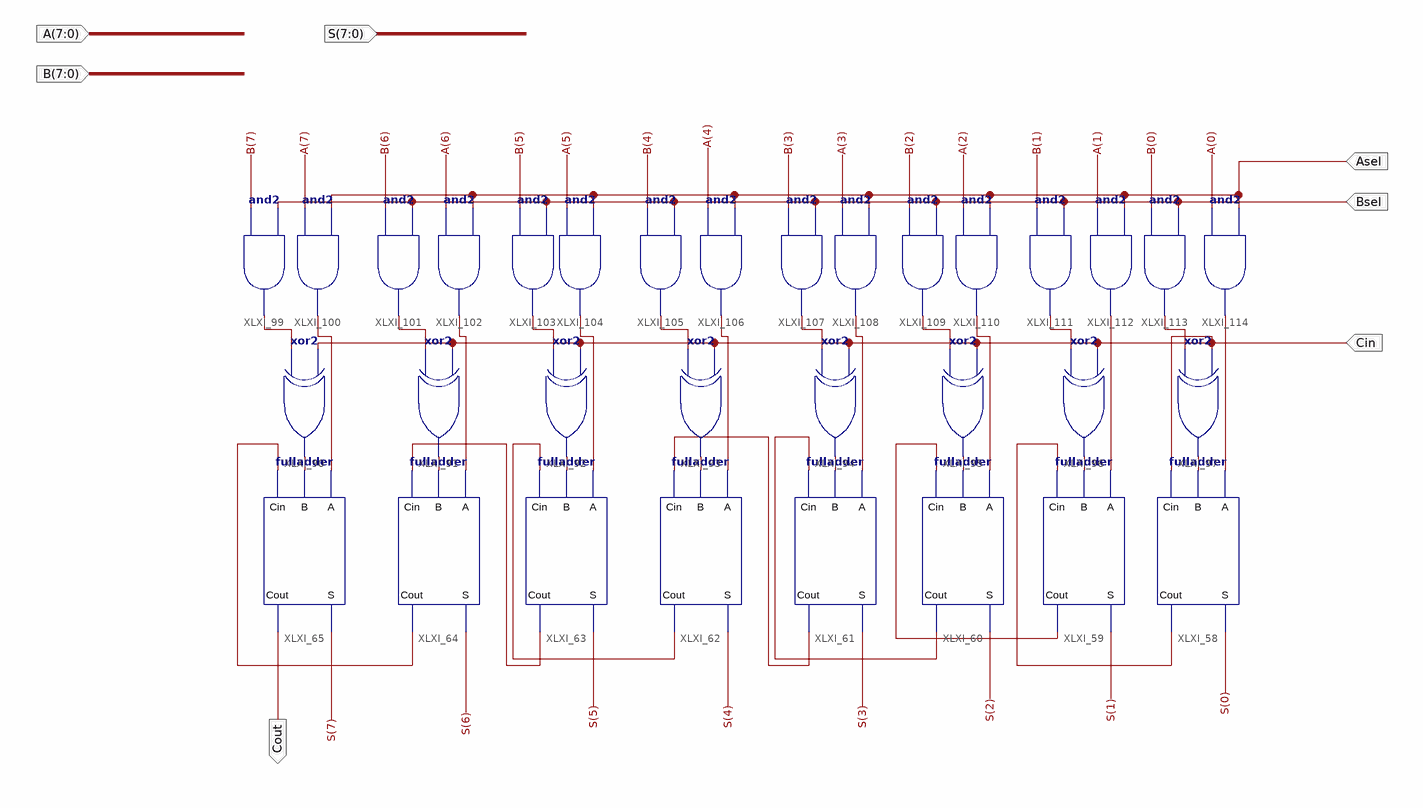
[diagram p0: schematic sheet 1]
// Xilinx ISE schematic eightBitFullAdder.sch (spartan3) as structural Verilog: 32 symbols, 7 ports
module eightBitFullAdder (
  input  Cin,
  input  Bsel,
  input  Asel,
  input  [7:0] A,
  input  [7:0] B,
  output Cout,
  output [7:0] S
);

  wire XLXN_103, XLXN_104, XLXN_105, XLXN_106, XLXN_107, XLXN_108, XLXN_109, XLXN_110, XLXN_111, XLXN_112,
       XLXN_113, XLXN_114, XLXN_115, XLXN_116, XLXN_117, XLXN_141, XLXN_142, XLXN_143, XLXN_144, XLXN_145,
       XLXN_146, XLXN_147, XLXN_148, XLXN_149, XLXN_150, XLXN_151, XLXN_152, XLXN_153, XLXN_154, XLXN_155,
       XLXN_156;

  fulladder XLXI_58 (.A(XLXN_156), .B(XLXN_117), .Cin(Cin), .S(S[0]), .Cout(XLXN_109));
  fulladder XLXI_59 (.A(XLXN_154), .B(XLXN_116), .Cin(XLXN_109), .S(S[1]), .Cout(XLXN_108));
  fulladder XLXI_60 (.A(XLXN_152), .B(XLXN_115), .Cin(XLXN_108), .S(S[2]), .Cout(XLXN_107));
  fulladder XLXI_61 (.A(XLXN_150), .B(XLXN_114), .Cin(XLXN_107), .S(S[3]), .Cout(XLXN_106));
  fulladder XLXI_62 (.A(XLXN_148), .B(XLXN_113), .Cin(XLXN_106), .S(S[4]), .Cout(XLXN_105));
  fulladder XLXI_63 (.A(XLXN_146), .B(XLXN_112), .Cin(XLXN_105), .S(S[5]), .Cout(XLXN_104));
  fulladder XLXI_64 (.A(XLXN_144), .B(XLXN_111), .Cin(XLXN_104), .S(S[6]), .Cout(XLXN_103));
  fulladder XLXI_65 (.A(XLXN_142), .B(XLXN_110), .Cin(XLXN_103), .S(S[7]), .Cout(Cout));
  xor XLXI_90 (XLXN_110, XLXN_141, Cin);
  xor XLXI_91 (XLXN_111, XLXN_143, Cin);
  xor XLXI_92 (XLXN_112, XLXN_145, Cin);
  xor XLXI_93 (XLXN_113, XLXN_147, Cin);
  xor XLXI_94 (XLXN_114, XLXN_149, Cin);
  xor XLXI_95 (XLXN_115, XLXN_151, Cin);
  xor XLXI_96 (XLXN_116, XLXN_153, Cin);
  xor XLXI_97 (XLXN_117, XLXN_155, Cin);
  and XLXI_99 (XLXN_141, B[7], Bsel);
  and XLXI_100 (XLXN_142, A[7], Asel);
  and XLXI_101 (XLXN_143, B[6], Bsel);
  and XLXI_102 (XLXN_144, A[6], Asel);
  and XLXI_103 (XLXN_145, B[5], Bsel);
  and XLXI_104 (XLXN_146, A[5], Asel);
  and XLXI_105 (XLXN_147, B[4], Bsel);
  and XLXI_106 (XLXN_148, A[4], Asel);
  and XLXI_107 (XLXN_149, B[3], Bsel);
  and XLXI_108 (XLXN_150, A[3], Asel);
  and XLXI_109 (XLXN_151, B[2], Bsel);
  and XLXI_110 (XLXN_152, A[2], Asel);
  and XLXI_111 (XLXN_153, B[1], Bsel);
  and XLXI_112 (XLXN_154, A[1], Asel);
  and XLXI_113 (XLXN_155, B[0], Bsel);
  and XLXI_114 (XLXN_156, A[0], Asel);
endmodule
